# Altium schematic sheet Brake_SCH.SchDoc: Brake Chamber Test System
size 431 x 279 mm; CompanyName: Systems Cyber; Organization: Colorado State University; DocumentNumber: 1; Revision: 1; SheetNumber: 1; SheetTotal: 1
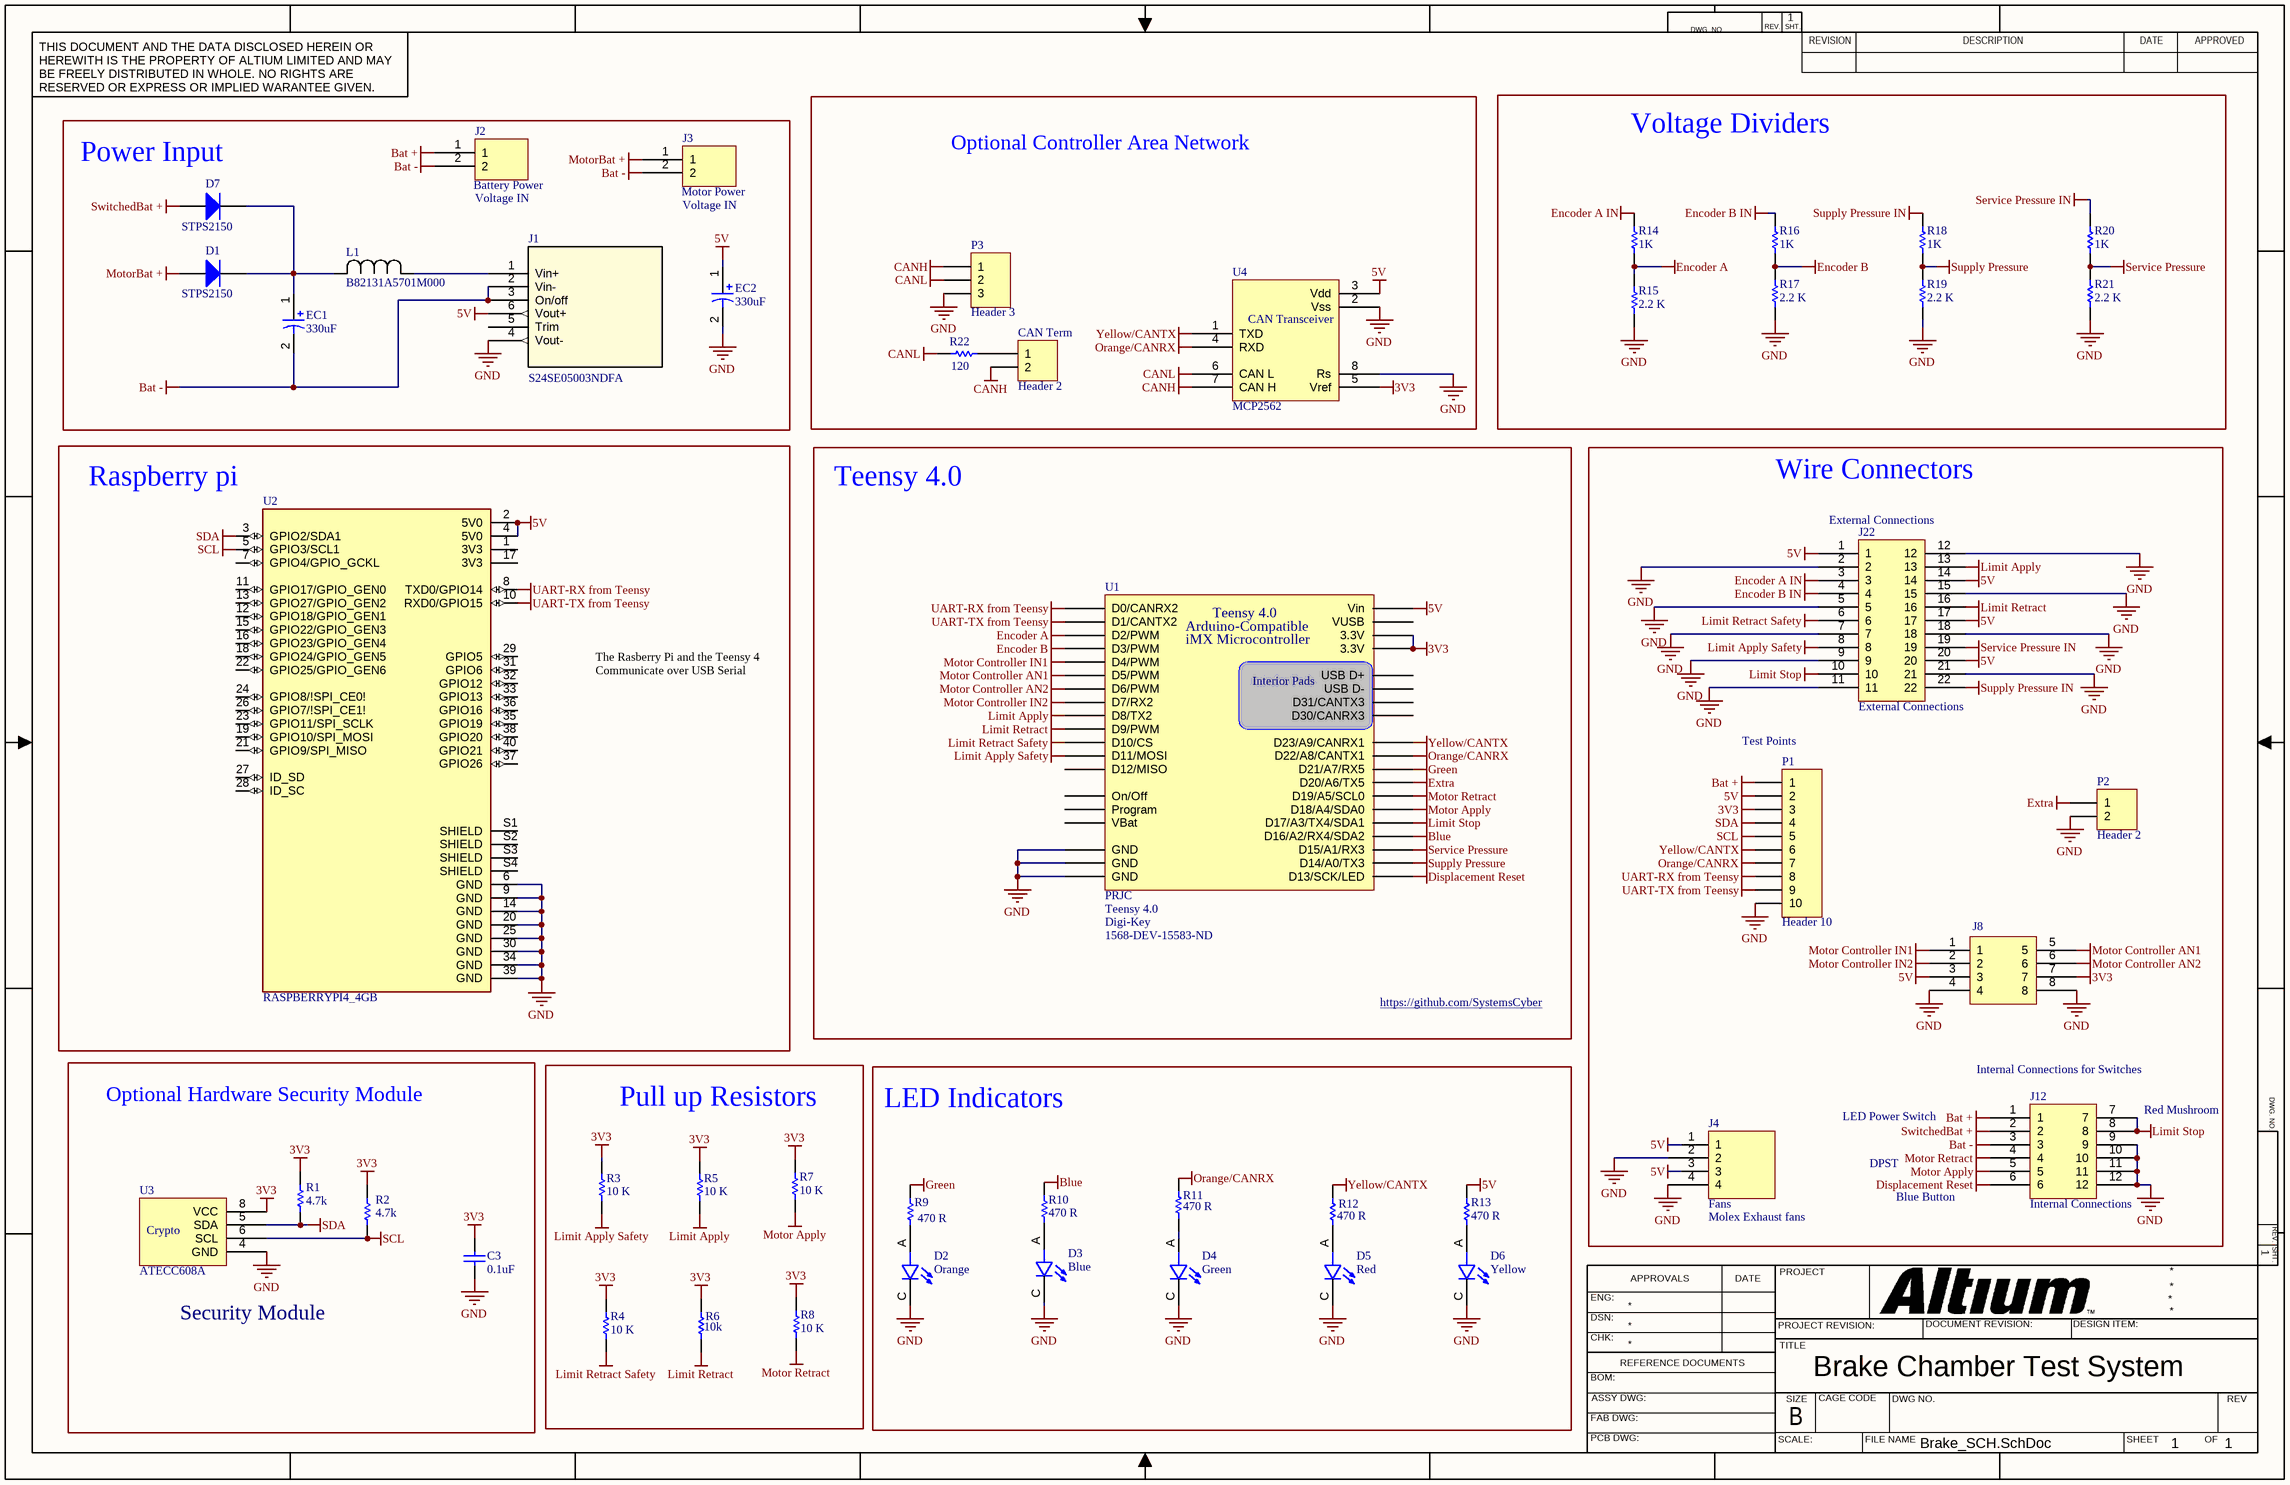
[diagram p0: Brake_SCH.SchDoc]

## Parts
C3  0.1uF  [CAPR5-4X5]
CAN_Term  Header 2  [HDR1X2]
D1  STPS2150  [DO-201AD]
D2  Orange  [LED_151054RS03000]
D3  Blue  [LED_151054RS03000]
D4  Green  [LED_151054RS03000]
D5  Red  [LED_151054RS03000]
D6  Yellow  [LED_151054RS03000]
D7  STPS2150  [DO-201AD]
EC1  330uF  [Cap - 15mm Polarized]
EC2  330uF  [Cap - 15mm Polarized]
J1  S24SE05003NDFA  [CONN6_3NDFA_DEA]
J2  Battery Power  Manufacturer: Voltage IN  [2 pos Mini-Fit Jr. R/A Header]
J3  Motor Power  Manufacturer: Voltage IN  [2 pos Mini-Fit Jr. R/A Header]
J4  Fans  Manufacturer: Molex Exhaust fans  [4 POS MINI-FIT JR]
J8  Motor Controller  [8 pos Mini-Fit Jr. R/A Header]  (value not drawn)
J12  Internal Connections  [12 pos Mini-Fit Jr. R/A Header]
J22  External Connections  [22 pos Mini-Fit Jr. R/A Header]
L1  B82131A5701M000  [AXIAL-0.8]
P1  Header 10  [HDR1X10]
P2  Header 2  [HDR1X2]
P3  Header 3  [HDR1X3]
R1  4.7k  [AXIAL-0.4]
R2  4.7k  [AXIAL-0.4]
R3  value 10 K  [AXIAL-0.4]  (hidden comment: 10k)
R4  value 10 K  [AXIAL-0.4]  (hidden comment: 10k)
R5  value 10 K  [AXIAL-0.4]  (hidden comment: 10k)
R6  10k  [AXIAL-0.4]
R7  value 10 K  [AXIAL-0.4]  (hidden comment: 10k)
R8  value 10 K  [AXIAL-0.4]  (hidden comment: 10k)
R9  value 470 R  [AXIAL-0.4]  (hidden comment: 470)
R10  value 470 R  [AXIAL-0.4]  (hidden comment: 470)
R11  value 470 R  [AXIAL-0.4]  (hidden comment: 470)
R12  value 470 R  [AXIAL-0.4]  (hidden comment: 470)
R13  value 470 R  [AXIAL-0.4]  (hidden comment: 470)
R14  1k  [AXIAL-0.4]
R15  value 2.2 K  [AXIAL-0.4]  (hidden comment: 2.2k)
R16  1k  [AXIAL-0.4]
R17  value 2.2 K  [AXIAL-0.4]  (hidden comment: 2.2k)
R18  1k  [AXIAL-0.4]
R19  value 2.2 K  [AXIAL-0.4]  (hidden comment: 2.2k)
R20  1k  [AXIAL-0.4]
R21  value 2.2 K  [AXIAL-0.4]  (hidden comment: 2.2k)
R22  120  [AXIAL-0.4]
U1  Manufacturer: PRJC  Supplier 1: Digi-Key  Supplier Part Number 1: 1568-DEV-15583-ND  [Teensy 4.0]  (hidden comment: Teensy 4.0)
U2  RASPBERRYPI4_4GB  [Mirrored MODULE_RASPBERRY_PI_3_MODEL_B]
U3  ATECC608A  [SOIC-8]
U4  MCP2562  [DIP8]

## Blocks framed on the sheet
https://github.com/SystemsCyber: U1
Security Module: C3 R1 R2 U3

## Nets
3V3: C3.2 J8.7 P1.3 R1.2 R2.2 R3.2 R4.2 R5.2 R6.2 R7.2 R8.2 U1.3V3a(3.3V) U1.3V3b(3.3V) U3.8(VCC) U4.5(Vref)
5V: EC2.1 J1.6(Vout+) J4.1 J4.3 J8.3 J22.1 J22.14 J22.17 J22.20 P1.2 R13.2 U1.Vin U2.2(5V0) U2.4(5V0) U4.3(Vdd)
Bat +: J2.1 J12.1 P1.1
Bat -: EC1.2 J1.2(Vin-) J1.3(On/off) J2.2 J3.2 J12.3
Blue: R10.2 U1.16(D16/A2/RX4/SDA2)
CANH: CAN_Term.2 P3.1 U4.7(CAN_H)
CANL: P3.2 R22.2 U4.6(CAN_L)
Displacement Reset: J12.6 U1.13(D13/SCK/LED)
Encoder A: R14.1 R15.2 U1.2(D2/PWM)
Encoder A IN: J22.3 R14.2
Encoder B: R16.1 R17.2 U1.3(D3/PWM)
Encoder B IN: J22.4 R16.2
Extra: P2.1 U1.20(D20/A6/TX5)
GND: C3.1 D2.C D3.C D4.C D5.C D6.C EC2.2 J1.4(Vout-) J4.2 J4.4 J8.4 J8.8 J12.9 J12.10 J12.11 J12.12 J22.2 J22.5 J22.7 J22.9 J22.11 J22.12 J22.15 J22.18 J22.21 P1.10 P2.2 P3.3 R15.1 R17.1 R19.1 R21.1 U1.G1(GND) U1.G2(GND) U1.G3(GND) U2.6(GND) U2.9(GND) U2.14(GND) U2.20(GND) U2.25(GND) U2.30(GND) U2.34(GND) U2.39(GND) U3.4(GND) U4.2(Vss) U4.8(Rs)
Green: R9.2 U1.21(D21/A7/RX5)
Limit Apply: J22.13 R5.1 U1.8(D8/TX2)
Limit Apply Safety: J22.8 R3.1 U1.11(D11/MOSI)
Limit Retract: J22.16 R6.1 U1.9(D9/PWM)
Limit Retract Safety: J22.6 R4.1 U1.10(D10/CS)
Limit Stop: J12.7 J12.8 J22.10 U1.17(D17/A3/TX4/SDA1)
Motor Apply: J12.5 R7.1 U1.18(D18/A4/SDA0)
Motor Controller AN1: J8.5 U1.5(D5/PWM)
Motor Controller AN2: J8.6 U1.6(D6/PWM)
Motor Controller IN1: J8.1 U1.4(D4/PWM)
Motor Controller IN2: J8.2 U1.7(D7/RX2)
Motor Retract: J12.4 R8.1 U1.19(D19/A5/SCL0)
MotorBat +: D1.1(A) J3.1
Orange/CANRX: P1.7 R11.2 U1.22(D22/A8/CANTX1) U4.4(RXD)
SCL: P1.5 R2.1 U2.5(GPIO3/SCL1) U3.6(SCL)
SDA: P1.4 R1.1 U2.3(GPIO2/SDA1) U3.5(SDA)
Service Pressure: R20.1 R21.2 U1.15(D15/A1/RX3)
Service Pressure IN: J22.19 R20.2
Supply Pressure: R18.1 R19.2 U1.14(D14/A0/TX3)
Supply Pressure IN: J22.22 R18.2
SwitchedBat +: D7.1(A) J12.2
UART-RX from Teensy: P1.8 U1.0(D0/CANRX2) U2.8(TXD0/GPIO14)
UART-TX from Teensy: P1.9 U1.1(D1/CANTX2) U2.10(RXD0/GPIO15)
Yellow/CANTX: P1.6 R12.2 U1.23(D23/A9/CANRX1) U4.1(TXD)
NetCAN_Term_1: CAN_Term.1 R22.1
NetD1_2: D1.2(K) D7.2(K) EC1.1 L1.2
NetD2_A: D2.A R9.1
NetD3_A: D3.A R10.1
NetD4_A: D4.A R11.1
NetD5_A: D5.A R12.1
NetD6_A: D6.A R13.1
NetJ1_1: J1.1(Vin+) L1.1

Not connected (* = marked no-connect by the designer): J1 5(Trim); U1 12(D12/MISO) CRX3(D30/CANRX3) CTX3(D31/CANTX3) D+(USB_D+) D-(USB_D-) On(On/Off) P(Program) VBat VUSB; U2 1(3V3) 7(GPIO4/GPIO_GCKL) 11(GPIO17/GPIO_GEN0) 12(GPIO18/GPIO_GEN1) 13(GPIO27/GPIO_GEN2) 15(GPIO22/GPIO_GEN3) 16(GPIO23/GPIO_GEN4) 17(3V3) 18(GPIO24/GPIO_GEN5) 19(GPIO10/SPI_MOSI) 21(GPIO9/SPI_MISO) 22(GPIO25/GPIO_GEN6) 23(GPIO11/SPI_SCLK) 24(GPIO8/!SPI_CE0!) 26(GPIO7/!SPI_CE1!) 27(ID_SD) 28(ID_SC) 29(GPIO5) 31(GPIO6) 32(GPIO12) 33(GPIO13) 35(GPIO19) 36(GPIO16) 37(GPIO26) 38(GPIO20) 40(GPIO21) S1(SHIELD) S2(SHIELD) S3(SHIELD) S4(SHIELD)

## Notes on the sheet
- (near D7) Power Input
- Voltage Dividers
- Optional Controller Area Network
- (near U2) Raspberry pi
- Teensy 4.0
- Wire Connectors
- (near J22) External Connections
- (near P1) Test Points
- The Rasberry Pi and the Teensy 4 Communicate over USB Serial
- (near J12) Internal Connections for Switches
- Optional Hardware Security Module
- Pull up Resistors
- LED Indicators
- LED Power Switch
- DPST
- (near J12) Red Mushroom
- Blue Button
- DWG. NO.
- REV.
- SHT.
- THIS DOCUMENT AND THE DATA DISCLOSED HEREIN OR HEREWITH IS THE PROPERTY OF ALTIUM LIMITED AND MAY BE FREELY DISTRIBUTED IN WHOLE. NO RIGHTS ARE RESERVED OR EXPRESS OR IMPLIED WARANTEE GIVEN.
- REVISION
- DESCRIPTION
- DATE
- APPROVED
- ENG:
- APPROVALS
- PROJECT
- DSN:
- CHK:
- REFERENCE DOCUMENTS
- PROJECT REVISION:
- TITLE
- DOCUMENT REVISION:
- DESIGN ITEM:
- BOM:
- FAB DWG:
- PCB DWG:
- ASSY DWG:
- SCALE:
- SIZE
- B
- CAGE CODE
- FILE NAME
- DWG NO.
- SHEET
- OF
- REV
- (in symbol ATECC508A) Crypto
- (in symbol MCP2551) CAN Transceiver
- (in symbol Teensy_4.0) Arduino-Compatible; iMX Microcontroller; Interior Pads

## Library data of the parts
C3 = Cap: Capacitor; Value: 0.1uF
CAN_Term P2 = Header 2: Header, 2-Pin
  CAN_Term: LatestRevisionDate: 17-Jul-2002; LatestRevisionNote: Re-released for DXP Platform.; Publisher: Altium Limited
D1 D7 = Diode 1N5408: DIODE SCHOTTKY 150V 2A DO15
D2-D6 = 151054RS03000: Red 623nm LED Indication - Discrete 1.9V Radial; Value: *
EC1 EC2 = Capacitor, Polarized: CAP ALUM 220UF 20% 100V RADIAL; Manufacturer: Nichicon; PartNumber: UBT2A221MHD1TN; Supplier 1: Digi-Key; Supplier Part Number 1: 493-4517-1-ND
J1 = S24SE05003NDFA: No Description Available; PartNumber: S24SE05003NDFA
J2 J3 = 2 Pos Header: PartNumber: 39-30-1020; Supplier 1: Mouser; Supplier Part Number 1: 538-39-30-1020
J4 = 4 Pos Header Vert: CONN HEADER 4POS 4.2MM VERT TIN; Supplier 1: Digi-Key; PartNumber: 39-29-9040
J8 = 8 Pos Header: CONN HEADER 8POS 4.2MM R/A TIN; Manufacturer: Molex; Supplier 1: Digi-Key; Supplier Part Number 1: WM21354-ND; PartNumber: 39-30-1080
J12 = 12 Pos Header: Manufacturer: Molex; Supplier 1: Digi-Key; PartNumber: 39-30-1120
J22 = 22 Pos Header: Manufacturer: Molex; Supplier 1: Digi-Key; PartNumber: 39-30-1220
L1 = 8230-20-RC: 14 µH Unshielded Drum Core, Wirewound Inductor 700 mA 760mOhm Axial; PartNumber: 8230-20-RC
P1 = Header 10: Header, 10-Pin; LatestRevisionDate: 17-Jul-2002; LatestRevisionNote: Re-released for DXP Platform.; Publisher: Altium Limited
P3 = Header 3: Header, 3-Pin; LatestRevisionDate: 17-Jul-2002; LatestRevisionNote: Re-released for DXP Platform.; Publisher: Altium Limited
R1 R2 = Res1: Resistor; Value: 10K
R3-R22 = Res1: Resistor
  R6: Value: 10 K
  R14 R16 R18 R20: Value: 1K
  R22: Value: 120
U1 = Teensy_4.0: 32 Bit Arduino-Compatible iMX Microcontroller; PartNumber: Teensy 4.0
U2 = RASPBERRYPI4_4GB: BCM2711 Raspberry Pi 4 Model B 4GB - ARMÂ® CortexÂ®-A72 MPU Embedded Evaluation Board; Value: *
U3 = ATECC508A: Authentication Chip IC Networking and Communications 8-SOIC; Manufacturer: Microchip Technology; PartNumber: ATECC508A-SSHDA-T; Supplier Part Number 1: ATECC508A-SSHDA-TCT-ND; Supplier 1: Digi-Key
U4 = MCP2551: Supplier 1: Digi-Key